# Altium schematic sheet power.SchDoc
size A3
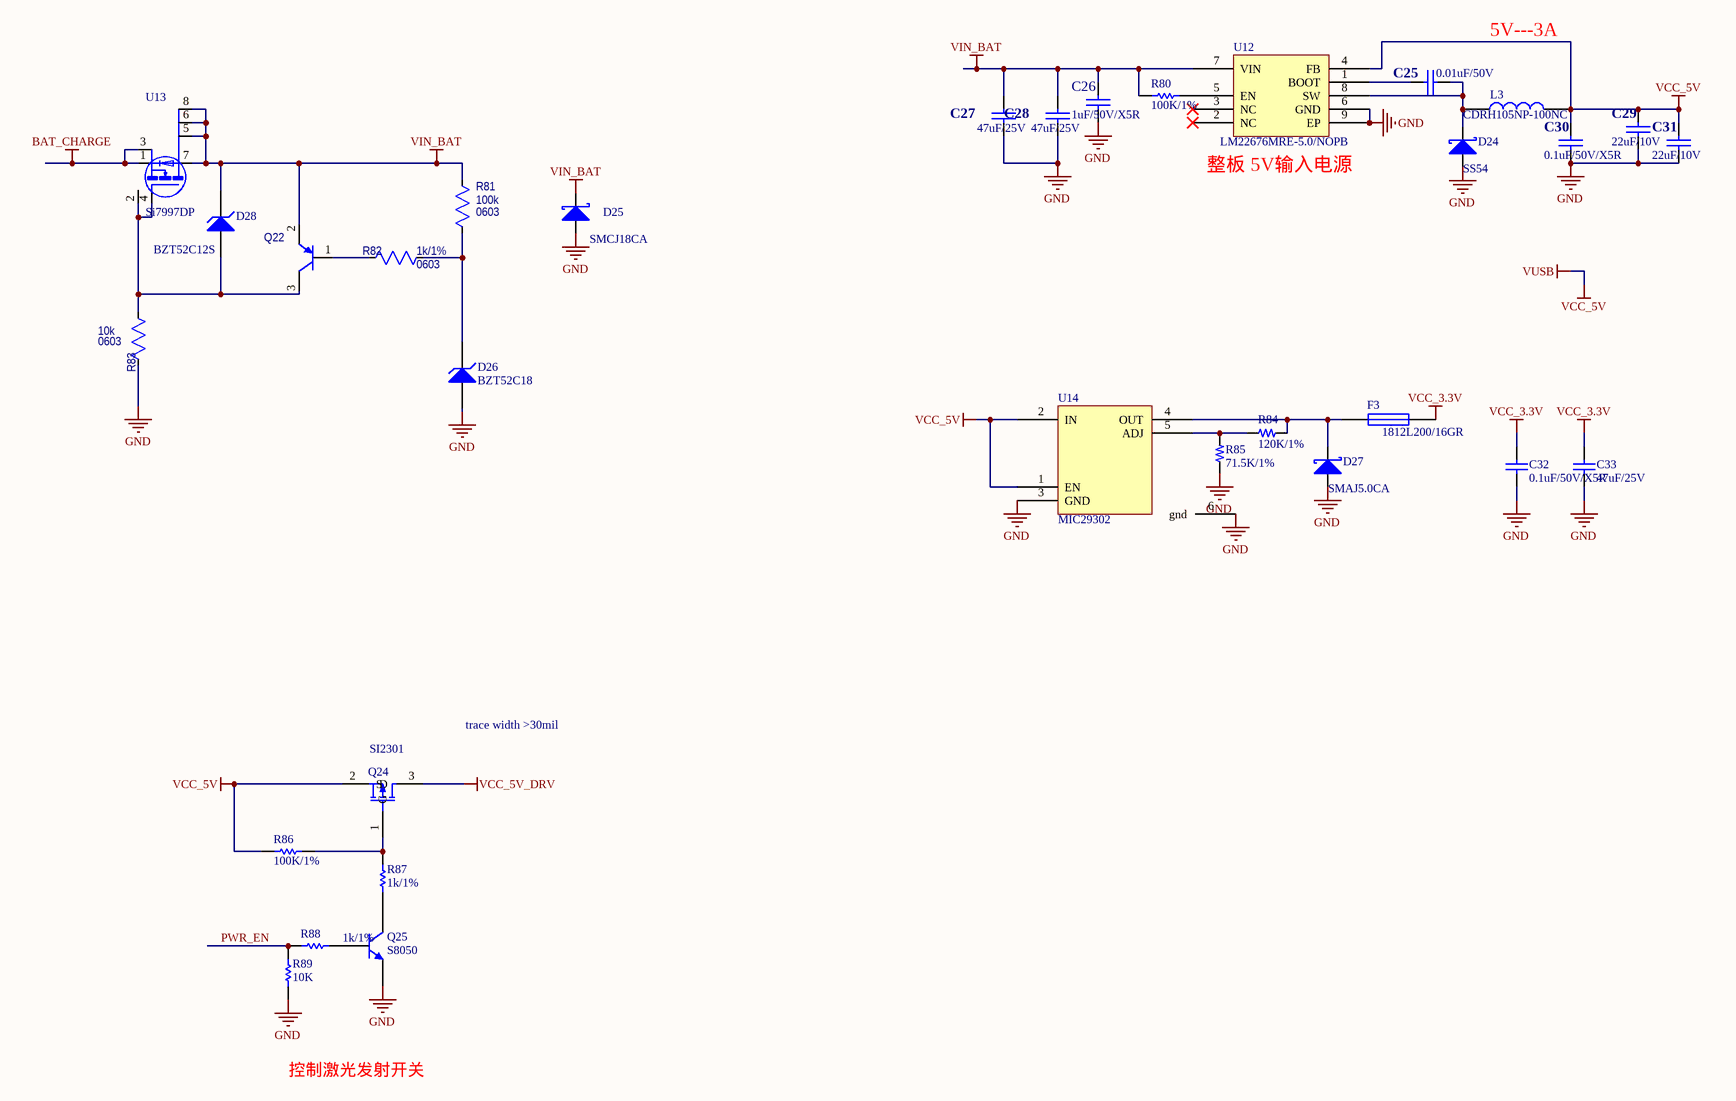
[diagram p0: power.SchDoc]

## Parts
C25  0.01uF/50V  [0603C]
C26  1uF/50V/X5R  [0603C]
C27  47uF/25V  [1210C]
C28  47uF/25V  [1210C]
C29  22uF/10V  [1210C]
C30  0.1uF/50V/X5R  [0603C]
C31  22uF/10V  [1210C]
C32  0.1uF/50V/X5R  [0603C]
C33  47uF/25V  [1206C]
D24  SS54  [SMC]
D25  SMCJ18CA  [SMC]
D26  BZT52C18  [sod123]
D27  SMAJ5.0CA  [SMA]
D28  BZT52C12S  [DIOD-SOD323-2_V]
F3  1812L200/16GR  [1812-F]
L3  CDRH105NP-100NC  [CDRH105]
Q22  MMBT4403-7-F  [SOT23-3]  (value not drawn)
Q24  SI2301  [SOT23-3]
Q25  S8050  [SOT23-3]
R80  100K/1%  [0603R]
R81  value 100k  Package: 0603  [0603R]  (hidden comment: 100K/1%)
R82  Package: 0603  [0603R]  (hidden comment: 1k/1%)
R83  Package: 0603  [0603R]  (hidden comment: 10k)
R84  120K/1%  [0603R]
R85  71.5K/1%  [0603R]
R86  100K/1%  [0603R]
R87  1k/1%  [0603R]
R88  1k/1%  [0603R]
R89  10K  [0603R]
U12  LM22676MRE-5.0/NOPB  [SOP127P600X168_HS-8N]
U13  Si7997DP  [PowerPAK SO-8]
U14  MIC29302  [TO228P1435X457-6N]

## Nets
BAT_CHARGE: U13.1(S) U13.3(S)
GND: C26.1 C27.2 C28.2 C29.2 C30.2 C31.2 C32.1 C33.1 D24.1(A) D25.1(A) D26.1(A) D27.1(A) Q25.2(E) R83.2 R85.1 R89.2 U12.6(GND) U12.9(EP) U14.3(GND) U14.6(gnd)
VCC_3.3V: C32.2 C33.2 F3.2
VCC_5V: C29.1 C30.1 C31.1 L3.2 Q24.2(S) R86.2 U12.4(FB) U14.1(EN) U14.2(IN)  [also labelled VUSB]
VCC_5V_DRV: Q24.3(D)
VIN_BAT: C26.2 C27.1 C28.1 D25.2(K) D28.2(K) Q22.2(E) R80.2 R81.2 U12.7(VIN) U13.5(D) U13.6(D) U13.7(D) U13.8(D)
PWR_EN: R88.2 R89.1
NetC25_1: C25.1 D24.2(K) L3.1 U12.8(SW)
NetC25_2: C25.2 U12.1(BOOT)
NetD26_2: D26.2(K) R81.1 R82.1
NetD27_2: D27.2(K) F3.1 R84.1 U14.4(OUT)
NetD28_1: D28.1(A) Q22.3(C) R83.1 U13.2(G) U13.4(G)
NetQ22_1: Q22.1(B) R82.2
NetQ24_1: Q24.1(G) R86.1 R87.2
NetQ25_1: Q25.1(B) R88.1
NetQ25_3: Q25.3(C) R87.1
NetR80_1: R80.1 U12.5(EN)
NetR84_2: R84.2 R85.2 U14.5(ADJ)

Not connected (* = marked no-connect by the designer): U12 2(NC)* 3(NC)*

## Notes on the sheet
- 5V---3A
- (near U12) 整板 5V输入电源
- trace width >30mil
- 控制激光发射开关

## Library data of the parts
C25-C31 = CAP: Capacitor
C32 C33 = Cap: Capacitor; Value: 22nF; Published: 8-Jun-2000; LatestRevisionDate: 17-Jul-2002; LatestRevisionNote: Re-released for DXP Platform.; PackageReference: RAD-0.3; Publisher: Altium Limited; PackageDescription: Radial Cap, Thru-Hole; 2 Leads; 0.3 in Pin Spacing
D24 D25 D27 = DIODE S: Schottky Diode
D26 = BZT52C12S-7-F: Zener Current: 5mA; Vz - Zener Voltage: 12V; Pd - Power Dissipation: 200mW; Zz - Zener Impedance: 40Ohms; Unit Weight: 0.000173oz; Voltage Temperature Coefficient: 0.25mV/C; Voltage Tolerance: 5%; Package Reference: SOD323-2; Minimum Operating Temperature: -65C; Packaging: Reel; Product Category: ZenerDiodes; Termination Style: SMD/SMT; Mounting Style: SMD/SMT; RoHS: True; Package / Case: SOD-323; Package Description: 2-Pin Surface Mount Device, Body 1.7 x 1.3 mm; Width: 1.4mm; Mounting Technology: SurfaceMount; Package URL: http://www.vishay.com/docs/71192/71192.pdf; Series: BZT52C12; Value: BZT52C12S-7-F
D28 = BZT52C12S-7-F: Surface Mount Zener Diode, 12 V, -65 to 150 degC, 2-Pin SOD323, RoHS, Tape and Reel; Manufacturer: DiodesIncorporated; Zener Current: 5mA; Vz - Zener Voltage: 12V; Zz - Zener Impedance: 40Ohms; Voltage Temperature Coefficient: 0.25mV/C; Voltage Tolerance: 5%; Width: 1.4mm; Value: BZT52C12S
F3 = Fuse 1: Fuse; Published: 8-Jun-2000; LatestRevisionDate: 17-Jul-2002; LatestRevisionNote: Re-released for DXP Platform.; PackageReference: PIN-W2/E2.8; Publisher: Altium Limited; PackageDescription: Thru-Hole; 2 Leads
L3 = INDUCTOR
Q22 = OEM_Diodes_MMBT4403: Supplier 1: *; Supplier Part Number 1: *; Value: MMBT4403-7-F
Q24 = MOSFET-P: P-Channel MOSFET; Published: 8-Jun-2000; LatestRevisionDate: 17-Jul-2002; LatestRevisionNote: Re-released for DXP Platform.; PackageVersion: 1995/1996; PackageReference: E3; Publisher: Altium Limited
Q25 = NPN: NPN Bipolar Transistor; Published: 8-Jun-2000; LatestRevisionDate: 17-Jul-2002; LatestRevisionNote: Re-released for DXP Platform.; PackageReference: TO-226; Publisher: Altium Limited; Code_JEDEC: TO-226-AA
R80 R86-R89 = Res1: Resistor; Published: 8-Jun-2000; LatestRevisionDate: 17-Jul-2002; LatestRevisionNote: Re-released for DXP Platform.; PackageReference: AXIAL-0.3; Publisher: Altium Limited
R81 = Resistor_0603: PartNumber: RC0603FR-0716K9L; Power Rating: [power]; TempCo: [tempco]; Tolerance: tol; SupplierDescription: RES SMD 16.9K OHM 1% 1/10W 0603
R82 R83 = Resistor_0603: PartNumber: RC0603FR-071KL; Power Rating: [power]; TempCo: [tempco]; Tolerance: tol; SupplierDescription: RES SMD 1K OHM 1% 1/10W 0603
  R82: Value: 1k/1%
  R83: Value: 10k
R84 R85 = R
U12 = LM22676MR-5.0
U13 = Si7997DP: Sia430DJ